# EasyEDA schematic SCH_d_00_ex_04.json
TITLE: Sheet_1; REV: 1.0; Date: 2025-01-10; Sheet: 1/1; Drawn By: artem.v.ulyanov; Company: Your Company
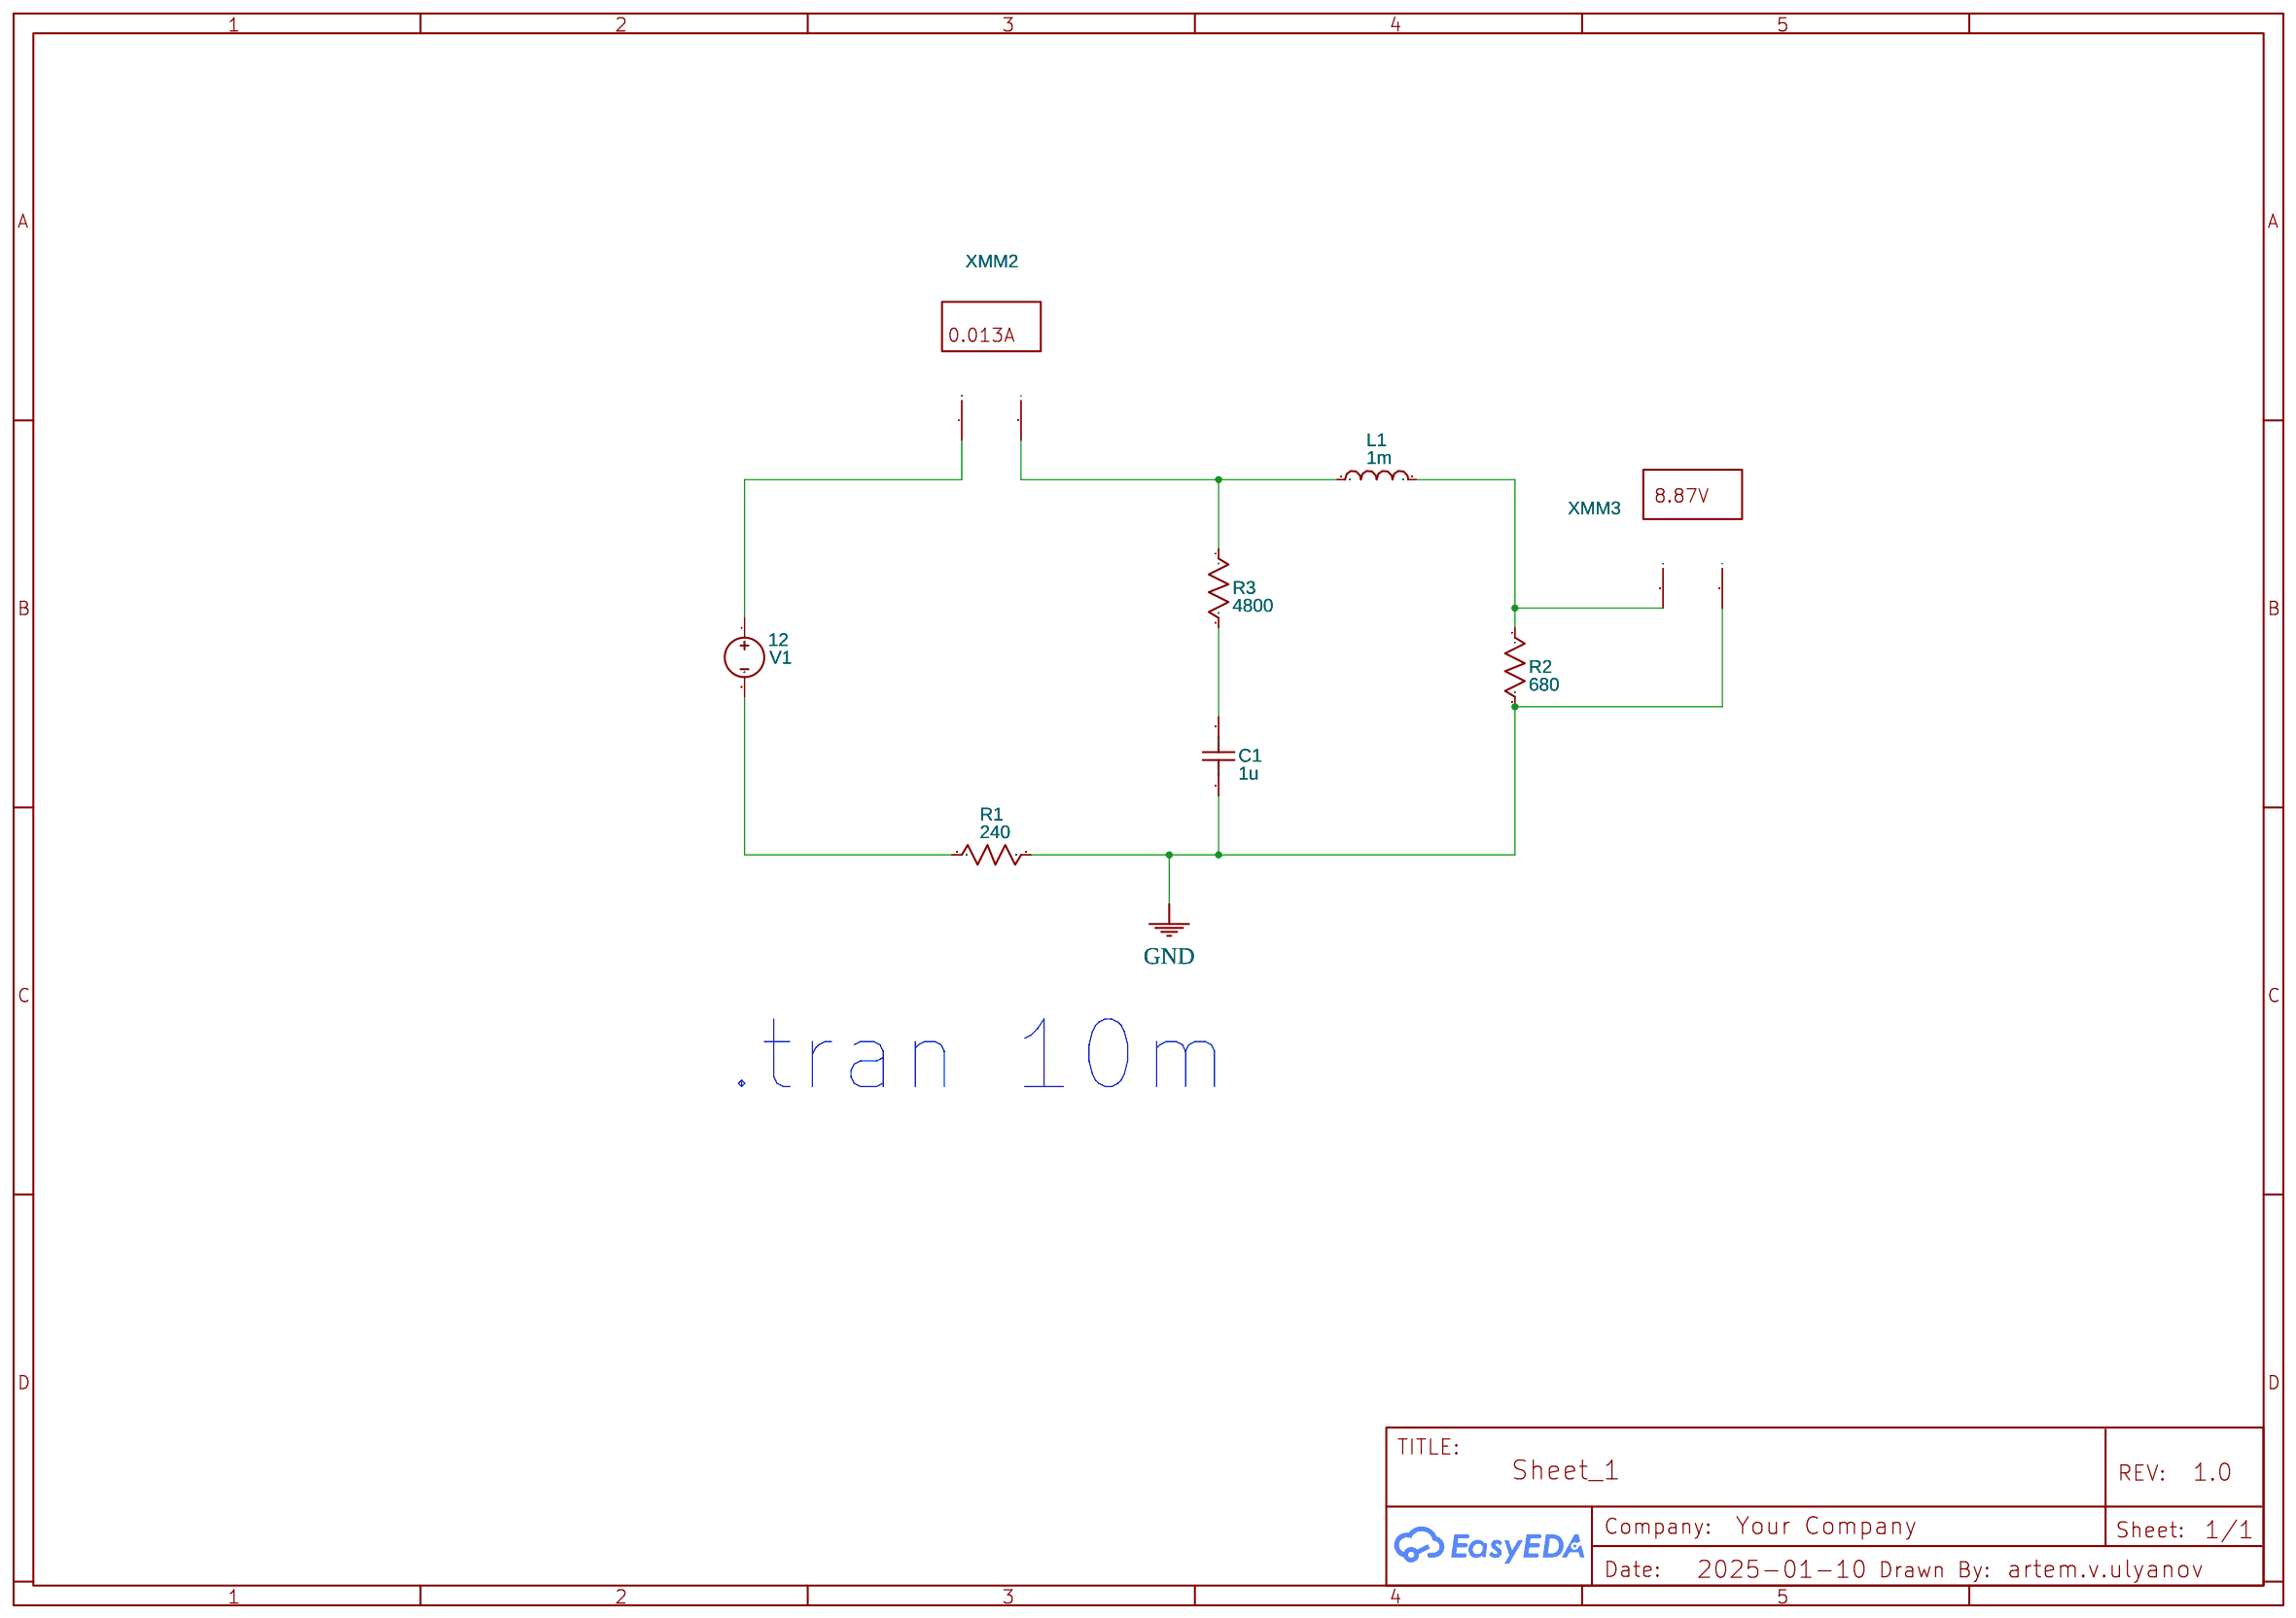
[diagram p0: schematic sheet]

## Parts
C1  1u  [RAD-0.1]
L1  1m  [AXIAL-0.4]
R1  240  [AXIAL-0.3]
R2  680  [AXIAL-0.3]
R3  4800  [AXIAL-0.3]
V1  12  [HDR1X2]
XMM2  Multimeter
XMM3  Multimeter

## Library data of the parts
C1 = Capacitor_US: Contributor: EasyEDA; Supplier: YUJING
L1 = Inductor: Supplier: YUJING; Contributor: EasyEDA
R1-R3 = Resistor_US: Resistance: 1k; Contributor: EasyEDA; Supplier: YUJING
V1 = VDC: Contributor: EasyEDA; sim: true
XMM2 = MULTIMETER: Supplier: LCSC; Multimeter Type: Amper; Power Type: AC; Voltmeter resistance: 10μ; Ammeter resistance: 1G; NameDisplay: 0; Contributor: EasyEDA; sim: true
XMM3 = MULTIMETER: Supplier: LCSC; Multimeter Type: Voltmeter; Power Type: AC; Voltmeter resistance: 10μ; Ammeter resistance: 1G; NameDisplay: 0; Contributor: EasyEDA; sim: true

## Nets
GND: C1.1 R1.2 R2.2 XMM3.2(I)
Net-(C1-2): C1.2 R3.2
Net-(L1-1): L1.1 R3.1 XMM2.2(I)
Net-(L1-2): L1.2 R2.1 XMM3.1(+)
Net-(R1-1): R1.1 V1.2
Net-(V1-1): V1.1 XMM2.1(+)

## Notes on the sheet
- .tran 10m
